# Altium schematic sheet ETZ_TWICE.SchDoc
size 420 x 297 mm; ApprovedBy: Мерзлякова Ю.И; CheckedBy: Сидоров М.А; Author: Сидоров М.А; DrawnBy: Сидоров М.А; SheetNumber: 2; SheetTotal: 2
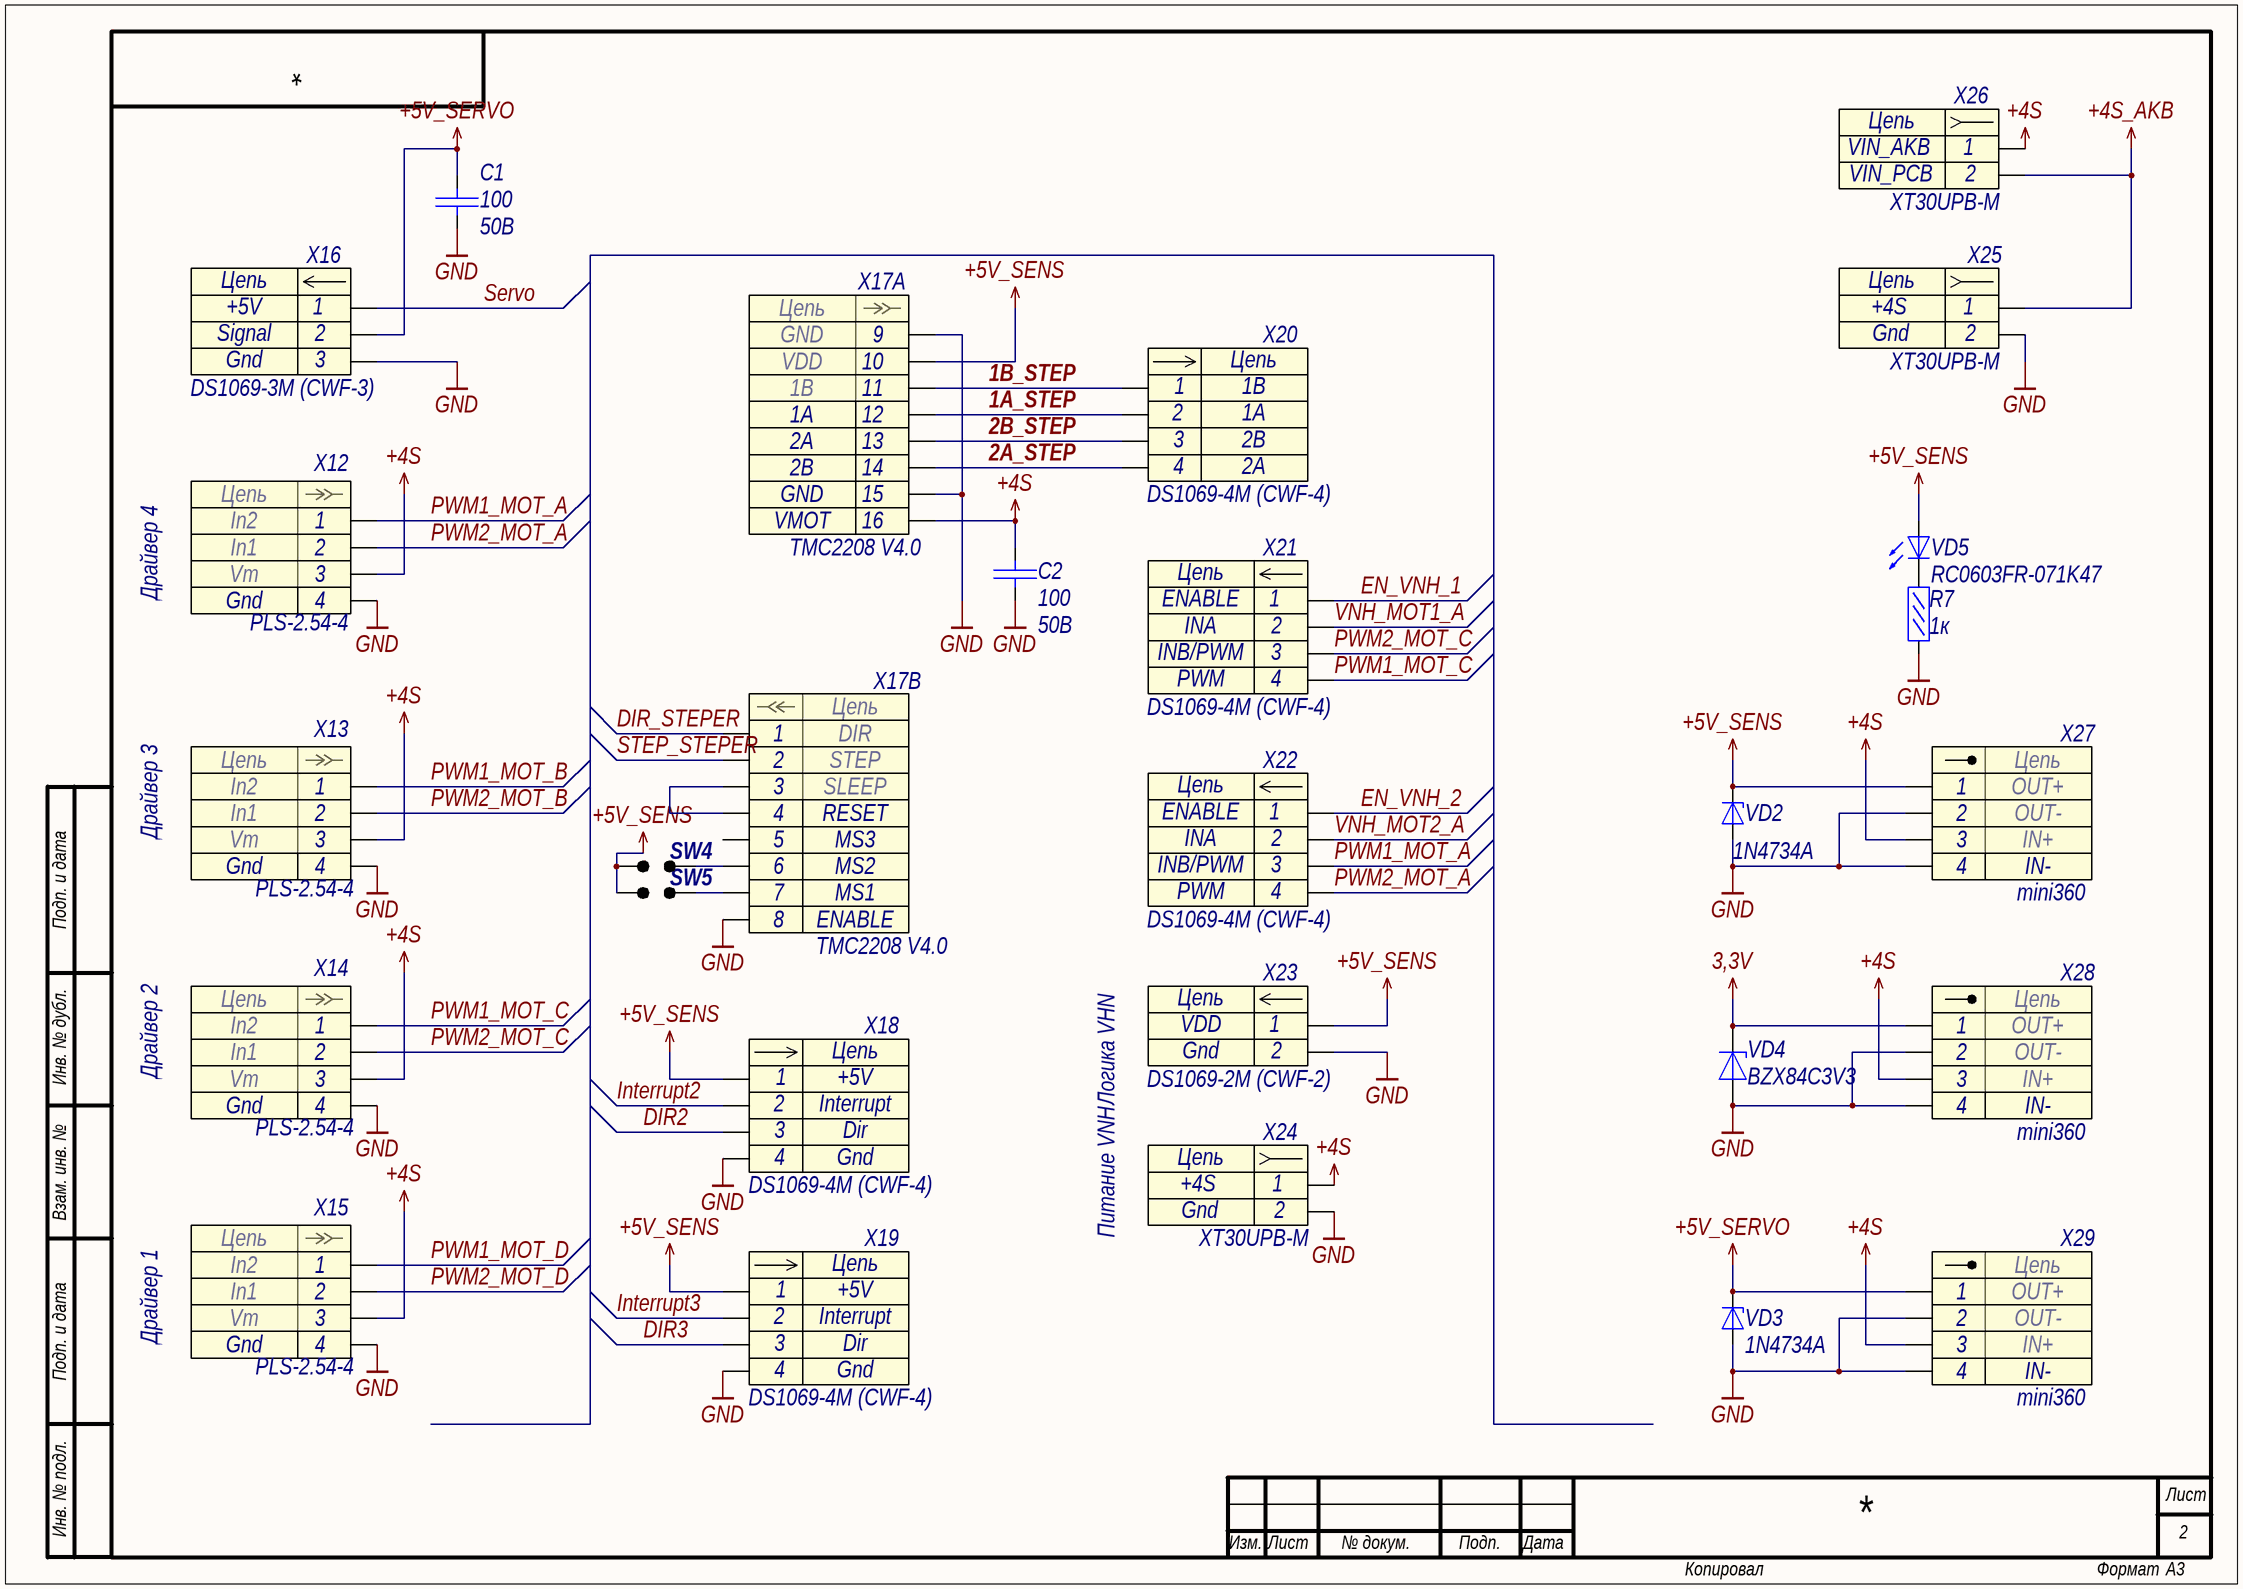
[diagram p0: ETZ_TWICE.SchDoc]

## Parts
C1  Voltage: 50В  [C0603]  (hidden comment: 100)
C2  Voltage: 50В  [C0603]  (hidden comment: 100)
R7  1к  [R0603]
SW4  (no value)  [Jumper_0.5x1]
SW5  (no value)  [Jumper_0.5x1]
VD2  1N4734A  [DO-41]
VD3  1N4734A  [DO-41]
VD4  BZX84C3V3  [SOT23-3]
VD5  RC0603FR-071K47  [VD0603]
X12  PLS-2.54-4  [DRV8871]
X13  PLS-2.54-4  [DRV8871]
X14  PLS-2.54-4  [DRV8871]
X15  PLS-2.54-4  [DRV8871]
X16  DS1069-3M (CWF-3)  [CWF-3]
X17  TMC2208 V4.0  [A4988]  (parts A,B of 2)
X18  DS1069-4M (CWF-4)  [CWF-4]
X19  DS1069-4M (CWF-4)  [CWF-4]
X20  DS1069-4M (CWF-4)  [CWF-4]
X21  DS1069-4M (CWF-4)  [CWF-4]
X22  DS1069-4M (CWF-4)  [CWF-4]
X23  DS1069-2M (CWF-2)  [CWF-2]
X24  XT30UPB-M  [XT30UPB-M]
X25  XT30UPB-M  [XT30UPB-M]
X26  XT30UPB-M  [XT30UPB-M]
X27  mini360  [mini360]
X28  mini360  [mini360]
X29  mini360  [mini360]

## Nets
3,3V: VD4.3(K) X28.1
+4S: C2.1 X12.3 X13.3 X14.3 X15.3 X17.16 X24.1 X26.1 X27.3 X28.3 X29.3
+4S_AKB: X25.1 X26.2
+5V_SENS: SW4.1 SW5.1 VD2.2(K) VD5.1(A) X17.10 X18.1 X19.1 X23.1 X27.1
+5V_SERVO: C1.1 VD3.2(K) X16.2 X29.1
GND: C1.2 C2.2 R7.1 VD2.1(A) VD3.1(A) VD4.1(A) X12.4 X13.4 X14.4 X15.4 X16.3 X17.8 X17.9 X17.15 X18.4 X19.4 X23.2 X24.2 X25.2 X27.2 X27.4 X28.2 X28.4 X29.2 X29.4
1A_STEP: X17.12 X20.2
1B_STEP: X17.11 X20.1
2A_STEP: X17.14 X20.4
2B_STEP: X17.13 X20.3
DIR2: X18.3
DIR3: X19.3
DIR_STEPER: X17.1
EN_VNH_1: X21.1
EN_VNH_2: X22.1
Interrupt2: X18.2
Interrupt3: X19.2
PWM1_MOT_A: X12.1 X22.3
PWM1_MOT_B: X13.1
PWM1_MOT_C: X14.1 X21.4
PWM1_MOT_D: X15.1
PWM2_MOT_A: X12.2 X22.4
PWM2_MOT_B: X13.2
PWM2_MOT_C: X14.2 X21.3
PWM2_MOT_D: X15.2
Servo: X16.1
STEP_STEPER: X17.2
VNH_MOT1_A: X21.2
VNH_MOT2_A: X22.2
NetR7_2: R7.2 VD5.2(K)
NetSW4_2: SW4.2 X17.6
NetSW5_2: SW5.2 X17.7
NetX17_3: X17.3 X17.4

Not connected (* = marked no-connect by the designer): X17 5; X27 0; X28 0; X29 0

## Notes on the sheet
- Драйвер 4
- Драйвер 3
- Драйвер 2
- Логика VHN
- Питание VNH
- Драйвер 1
- Подп. и дата
- Инв. № дубл.
- Взам. инв. №
- Инв. № подл.
- Лист
- Изм.
- № докум.
- Подп.
- Дата
- Копировал
- Формат
- А3
- (in symbol A4988, part A) Цепь; GND; VDD; 1B; 1A; 2A; 2B; VMOT
- (in symbol A4988, part B) Цепь; DIR; STEP; SLEEP; RESET; MS3; MS2; MS1; ENABLE
- (in symbol CWF-2) Цепь
- (in symbol CWF-3) Цепь
- (in symbol CWF-4) Цепь
- (in symbol mini360) Цепь; OUT+; OUT-; IN+; IN-
- (in symbol PLS-2.54-4) Цепь
- (in symbol XT30UPB-M) Цепь

## Library data of the parts
C1 C2 = CC0603JRNPO9BN101: Конденсатор кер. 100пФ 50В; Manufacturer: Yageo; TKE: NP0; Name: CC0603JRNPO9BN101; Value: 100
R7 = RC0603FR-071KL: Резистор 1кОм 0,063Вт 1%; Manufacturer: YAGEO; Name: RC0603FR-071KL; Tolerance: 1%; Value: 1к
SW4 SW5 = Jumper: Перемычка
VD2 VD3 = 1N4734A: Стабилитрон 5.6В, 5%, 1Вт, 1N4734A; Voltage MAX: 5.88; Voltage MIN: 5.32; Name: 1N4734A; ComponentLink1Description: HelpURL; ComponentLink1URL: https://www.promelec.ru/fs/sources/54/98/aa/7a/f161d9308e45db5c55639eb6.pdf
VD4 = BZX84C3V3: Стабилитрон 3,3В; Name: BZX84C3V3
VD5 = FYLS-0603BUGC: Светодтод зеленый SMD Foryard Optoelectronics Co.; Name: Зеленый светодиод
X12-X15 = PLS-2.54-4: Contact_1: In2; Contact_2: In1; Contact_3: Vm; Contact_4: Gnd; nam: PLS-2.54-4
X16 = CWF-3: Разъем - 3 конт. прямая вилка на плату; Contact_1: +5V; Contact_2: Signal; Contact_3: Gnd; Name: DS1069-3M (CWF-3)
X17 = A4988
X18 X19 = CWF-4: Разъем - 4 конт. прямая вилка на плату; Contact_1: +5V; Contact_2: Interrupt; Contact_3: Dir; Contact_4: Gnd; Name: DS1069-4M (CWF-4)
X20 = CWF-4: Разъем - 4 конт. прямая вилка на плату; Contact_1: 1B; Contact_2: 1A; Contact_3: 2B; Contact_4: 2A; Name: DS1069-4M (CWF-4)
X21 X22 = CWF-4: Разъем - 4 конт. прямая вилка на плату; Contact_1: ENABLE; Contact_2: INA; Contact_3: INB/PWM; Contact_4: PWM; Name: DS1069-4M (CWF-4)
X23 = CWF-2: Разъем - 2 конт. прямая вилка на плату; Contact_1: VDD; Contact_2: Gnd; Name: DS1069-2M (CWF-2)
X24 X25 = XT30UPB-M: Contact_1: +4S; Contact_2: Gnd; Name: XT30UPB-M
X26 = XT30UPB-M: Contact_1: VIN_AKB; Contact_2: VIN_PCB; Name: XT30UPB-M
X27-X29 = mini360: стаб 18 на 12 мм